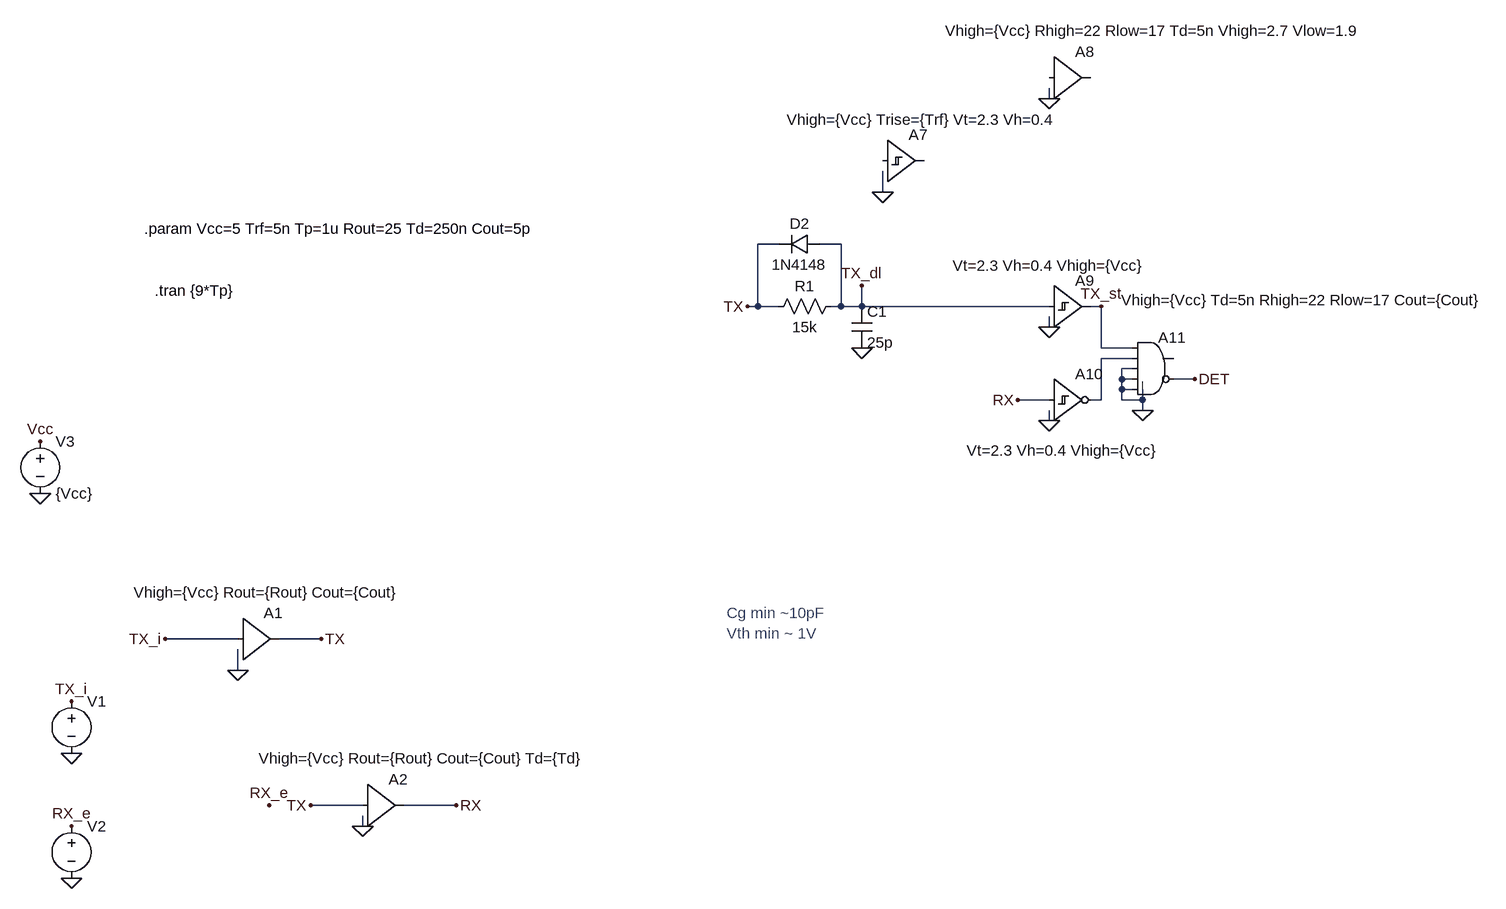
[diagram p0: schematic collision_logic.asc]
collision_logic.asc, the LTspice schematic file:
Version 4
SHEET 1 2144 732
WIRE 864 -624 864 -640
WIRE 608 -480 608 -512
WIRE 448 -400 416 -400
WIRE 544 -400 512 -400
WIRE 416 -304 416 -400
WIRE 416 -304 400 -304
WIRE 448 -304 416 -304
WIRE 544 -304 544 -400
WIRE 544 -304 528 -304
WIRE 576 -304 576 -336
WIRE 576 -304 544 -304
WIRE 864 -304 576 -304
WIRE 944 -304 928 -304
WIRE 864 -272 864 -288
WIRE 944 -240 944 -304
WIRE 992 -240 944 -240
WIRE 992 -224 944 -224
WIRE 992 -208 976 -208
WIRE 976 -192 976 -208
WIRE 992 -192 976 -192
WIRE 1088 -192 1056 -192
WIRE 976 -176 976 -192
WIRE 992 -176 976 -176
WIRE 864 -160 816 -160
WIRE 944 -160 944 -224
WIRE 944 -160 928 -160
WIRE 976 -160 976 -176
WIRE 1008 -160 1008 -176
WIRE 1008 -160 976 -160
WIRE 1008 -144 1008 -160
WIRE 864 -128 864 -144
WIRE -384 208 -496 208
WIRE -256 208 -320 208
WIRE -384 256 -384 224
WIRE -192 464 -272 464
WIRE -48 464 -128 464
WIRE -192 496 -192 480
FLAG -384 256 0
FLAG -496 208 TX_i
FLAG -640 384 0
FLAG -640 304 TX_i
FLAG -256 208 TX
FLAG -640 576 0
FLAG -640 496 RX_e
FLAG -688 -16 0
FLAG -688 -96 Vcc
FLAG 608 -480 0
FLAG 864 -272 0
FLAG 864 -128 0
FLAG 1008 -144 0
FLAG 1088 -192 DET
FLAG -192 496 0
FLAG 864 -624 0
FLAG -48 464 RX
FLAG -336 464 RX_e
FLAG 400 -304 TX
FLAG 816 -160 RX
FLAG 576 -240 0
FLAG 576 -336 TX_dl
FLAG 944 -304 TX_st
FLAG -272 464 TX
SYMBOL Digital\\buf1 -384 144 R0
WINDOW 123 -160 -8 Left 2
SYMATTR Value2 Vhigh={Vcc} Rout={Rout} Cout={Cout}
SYMATTR InstName A1
SYMBOL voltage -640 288 R0
WINDOW 3 24 96 Invisible 2
WINDOW 123 0 0 Left 0
WINDOW 39 0 0 Left 0
SYMATTR Value PWL(0 0 {Tp} 0 {Tp+Trf} {Vcc} {4*Tp} {Vcc} {Trf+4*Tp} 0 {6*Tp} 0 {Trf+6*Tp} {Vcc} {7*Tp} {Vcc} {Trf+7*Tp} 0)
SYMATTR InstName V1
SYMBOL voltage -640 480 R0
WINDOW 3 24 96 Invisible 2
WINDOW 123 0 0 Left 0
WINDOW 39 0 0 Left 0
SYMATTR Value PWL(0 0 {2*Tp} 0 {Trf+2*Tp} {Vcc} {3*Tp} {Vcc} {Trf+3*Tp} 0 {5*Tp} 0 {Trf+5*Tp} {Vcc} {8*Tp} {Vcc} {Trf+8*Tp} 0)
SYMATTR InstName V2
SYMBOL voltage -688 -112 R0
SYMATTR InstName V3
SYMATTR Value {Vcc}
SYMBOL diode 512 -416 R90
WINDOW 0 0 32 VBottom 2
WINDOW 3 32 32 VTop 2
SYMATTR InstName D2
SYMATTR Value 1N4148
SYMBOL Digital\\buf1 864 -720 R0
WINDOW 123 -160 -8 Left 2
SYMATTR Value2 Vhigh={Vcc} Rhigh=22 Rlow=17 Td=5n Vhigh=2.7 Vlow=1.9
SYMATTR InstName A8
SYMBOL Digital\\schmtbuf 608 -592 R0
WINDOW 123 -148 1 Left 2
SYMATTR InstName A7
SYMATTR Value2 Vhigh={Vcc} Trise={Trf} Vt=2.3 Vh=0.4
SYMBOL Digital\\schmtbuf 864 -368 R0
WINDOW 123 -148 1 Left 2
SYMATTR InstName A9
SYMATTR Value2 Vt=2.3 Vh=0.4 Vhigh={Vcc}
SYMBOL Digital\\schmtinv 864 -224 R0
WINDOW 123 -127 142 Left 2
SYMATTR InstName A10
SYMATTR Value2 Vt=2.3 Vh=0.4 Vhigh={Vcc}
SYMBOL Digital\\and 1024 -272 R0
WINDOW 123 -49 -42 Left 2
SYMATTR InstName A11
SYMATTR Value2 Vhigh={Vcc} Td=5n Rhigh=22 Rlow=17 Cout={Cout}
SYMBOL Digital\\buf1 -192 400 R0
WINDOW 123 -160 -8 Left 2
SYMATTR Value2 Vhigh={Vcc} Rout={Rout} Cout={Cout} Td={Td}
SYMATTR InstName A2
SYMBOL cap 560 -304 R0
SYMATTR InstName C1
SYMATTR Value 25p
SYMBOL res 544 -320 R90
WINDOW 0 0 56 VBottom 2
WINDOW 3 32 56 VTop 2
SYMATTR InstName R1
SYMATTR Value 15k
TEXT -528 -424 Left 2 !.param Vcc=5 Trf=5n Tp=1u Rout=25 Td=250n Cout=5p
TEXT 368 168 Left 2 ;Cg min ~10pF\nVth min ~ 1V
TEXT -512 -328 Left 2 !.tran {9*Tp}

The netlist it stands for:
* collision_logic.asc
A1 TX_i 0 0 0 0 0 TX 0 BUF Vhigh={Vcc} Rout={Rout} Cout={Cout}
V1 TX_i 0 PWL(0 0 {Tp} 0 {Tp+Trf} {Vcc} {4*Tp} {Vcc} {Trf+4*Tp} 0 {6*Tp} 0 {Trf+6*Tp} {Vcc} {7*Tp} {Vcc} {Trf+7*Tp} 0)
V2 RX_e 0 PWL(0 0 {2*Tp} 0 {Trf+2*Tp} {Vcc} {3*Tp} {Vcc} {Trf+3*Tp} 0 {5*Tp} 0 {Trf+5*Tp} {Vcc} {8*Tp} {Vcc} {Trf+8*Tp} 0)
V3 Vcc 0 {Vcc}
D2 TX_dl TX 1N4148
A8 0 0 0 0 0 0 0 0 BUF Vhigh={Vcc} Rhigh=22 Rlow=17 Td=5n Vhigh=2.7 Vlow=1.9
A7 0 0 0 0 0 0 0 0 SCHMITT Vhigh={Vcc} Trise={Trf} Vt=2.3 Vh=0.4
A9 TX_dl 0 0 0 0 0 TX_st 0 SCHMITT Vt=2.3 Vh=0.4 Vhigh={Vcc}
A10 RX 0 0 0 0 N001 0 0 SCHMITT Vt=2.3 Vh=0.4 Vhigh={Vcc}
A11 TX_st N001 0 0 0 DET 0 0 AND Vhigh={Vcc} Td=5n Rhigh=22 Rlow=17 Cout={Cout}
A2 TX 0 0 0 0 0 RX 0 BUF Vhigh={Vcc} Rout={Rout} Cout={Cout} Td={Td}
C1 TX_dl 0 25p
R1 TX_dl TX 15k
.model D D
.lib standard.dio
.param Vcc=5 Trf=5n Tp=1u Rout=25 Td=250n Cout=5p
* Cg min ~10pF
* Vth min ~ 1V
.tran {9*Tp}
.backanno
.end